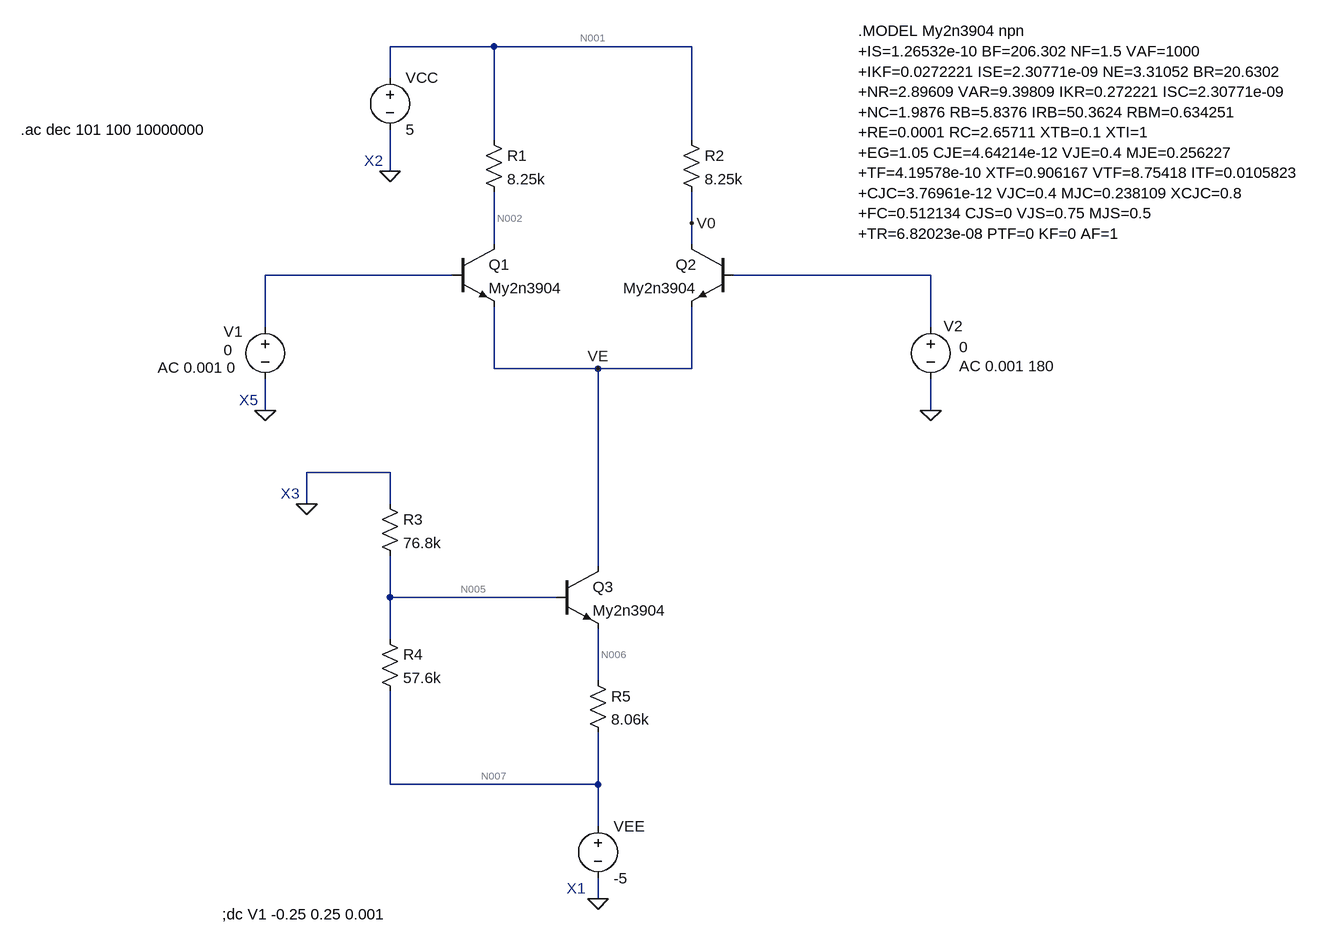
[diagram p0: schematic 3.2.asc]
3.2.asc, the LTspice schematic file:
Version 4
SHEET 1 1176 712
WIRE -128 -640 -288 -640
WIRE 176 -640 -128 -640
WIRE -288 -592 -288 -640
WIRE -128 -496 -128 -640
WIRE 176 -496 176 -640
WIRE -288 -448 -288 -512
WIRE 176 -368 176 -416
WIRE -128 -336 -128 -416
WIRE 176 -336 176 -368
WIRE -192 -288 -480 -288
WIRE 544 -288 240 -288
WIRE -480 -208 -480 -288
WIRE 544 -208 544 -288
WIRE -128 -144 -128 -240
WIRE 32 -144 -128 -144
WIRE 176 -144 176 -240
WIRE 176 -144 32 -144
WIRE -480 -80 -480 -128
WIRE 544 -80 544 -128
WIRE -288 16 -416 16
WIRE -416 64 -416 16
WIRE -288 64 -288 16
WIRE 32 160 32 -144
WIRE -288 208 -288 144
WIRE -32 208 -288 208
WIRE -288 272 -288 208
WIRE 32 336 32 256
WIRE -288 496 -288 352
WIRE 32 496 32 416
WIRE 32 496 -288 496
WIRE 32 560 32 496
WIRE 32 672 32 640
FLAG -288 -448 0
FLAG -480 -80 0
FLAG -416 64 0
FLAG 32 672 0
FLAG 32 -144 VE
FLAG 176 -368 V0
FLAG 544 -80 0
SYMBOL res -144 -512 R0
SYMATTR InstName R1
SYMATTR Value 8.25k
SYMBOL res 160 -512 R0
SYMATTR InstName R2
SYMATTR Value 8.25k
SYMBOL res -304 48 R0
SYMATTR InstName R3
SYMATTR Value 76.8k
SYMBOL res -304 256 R0
SYMATTR InstName R4
SYMATTR Value 57.6k
SYMBOL res 16 320 R0
SYMATTR InstName R5
SYMATTR Value 8.06k
SYMBOL voltage -288 -608 R0
WINDOW 123 0 0 Left 0
WINDOW 39 0 0 Left 0
SYMATTR InstName VCC
SYMATTR Value 5
SYMBOL npn -192 -336 R0
SYMATTR InstName Q1
SYMATTR Value My2n3904
SYMBOL npn 240 -336 M0
SYMATTR InstName Q2
SYMATTR Value My2n3904
SYMBOL voltage -480 -224 R0
WINDOW 0 -64 23 Left 2
WINDOW 3 -64 51 Left 2
WINDOW 123 -165 78 Left 2
WINDOW 39 0 0 Left 0
SYMATTR InstName V1
SYMATTR Value 0
SYMATTR Value2 AC 0.001 0
SYMBOL npn -32 160 R0
SYMATTR InstName Q3
SYMATTR Value My2n3904
SYMBOL voltage 32 544 R0
WINDOW 123 0 0 Left 0
WINDOW 39 0 0 Left 0
SYMATTR InstName VEE
SYMATTR Value -5
SYMBOL voltage 544 -224 R0
WINDOW 0 20 14 Left 2
WINDOW 3 44 47 Left 2
WINDOW 123 44 76 Left 2
WINDOW 39 0 0 Left 0
SYMATTR InstName V2
SYMATTR Value 0
SYMATTR Value2 AC 0.001 180
TEXT -328 -464 Left 2 ;X2
TEXT -520 -96 Left 2 ;X5
TEXT -456 48 Left 2 ;X3
TEXT -16 656 Left 2 ;X1
TEXT 432 -664 Left 2 !.MODEL My2n3904 npn\n+IS=1.26532e-10 BF=206.302 NF=1.5 VAF=1000\n+IKF=0.0272221 ISE=2.30771e-09 NE=3.31052 BR=20.6302\n+NR=2.89609 VAR=9.39809 IKR=0.272221 ISC=2.30771e-09\n+NC=1.9876 RB=5.8376 IRB=50.3624 RBM=0.634251\n+RE=0.0001 RC=2.65711 XTB=0.1 XTI=1\n+EG=1.05 CJE=4.64214e-12 VJE=0.4 MJE=0.256227\n+TF=4.19578e-10 XTF=0.906167 VTF=8.75418 ITF=0.0105823\n+CJC=3.76961e-12 VJC=0.4 MJC=0.238109 XCJC=0.8\n+FC=0.512134 CJS=0 VJS=0.75 MJS=0.5\n+TR=6.82023e-08 PTF=0 KF=0 AF=1
TEXT -546 696 Left 2 !;dc V1 -0.25 0.25 0.001
TEXT -856 -512 Left 2 !.ac dec 101 100 10000000

The netlist it stands for:
* 3.2.asc
R1 N001 N002 8.25k
R2 N001 V0 8.25k
R3 0 N005 76.8k
R4 N005 N007 57.6k
R5 N006 N007 8.06k
VCC N001 0 5
Q1 N002 N003 VE 0 My2n3904
Q2 V0 N004 VE 0 My2n3904
V1 N003 0 0 AC 0.001 0
Q3 VE N005 N006 0 My2n3904
VEE N007 0 -5
V2 N004 0 0 AC 0.001 180
.model NPN NPN
.model PNP PNP
.lib standard.bjt
* X2
* X5
* X3
* X1
.MODEL My2n3904 npn
+IS=1.26532e-10 BF=206.302 NF=1.5 VAF=1000
+IKF=0.0272221 ISE=2.30771e-09 NE=3.31052 BR=20.6302
+NR=2.89609 VAR=9.39809 IKR=0.272221 ISC=2.30771e-09
+NC=1.9876 RB=5.8376 IRB=50.3624 RBM=0.634251
+RE=0.0001 RC=2.65711 XTB=0.1 XTI=1
+EG=1.05 CJE=4.64214e-12 VJE=0.4 MJE=0.256227
+TF=4.19578e-10 XTF=0.906167 VTF=8.75418 ITF=0.0105823
+CJC=3.76961e-12 VJC=0.4 MJC=0.238109 XCJC=0.8
+FC=0.512134 CJS=0 VJS=0.75 MJS=0.5
+TR=6.82023e-08 PTF=0 KF=0 AF=1
;dc V1 -0.25 0.25 0.001
.ac dec 101 100 10000000
.backanno
.end

* Results of the author's LTspice run, read from the files saved beside the schematic
* Operating Point, zero values left out:
*   V(n001) = 5 V
*   V(n002) = 4.25 V
*   V(v0) = 4.25 V
*   V(n005) = -2.937 V
*   V(n007) = -5 V
*   V(n006) = -3.49 V
*   V(ve) = -525.4 mV
*   Ic(Q3) = 184.9 µA
*   Ib(Q3) = 2.429 µA
*   Ie(Q3) = -187.3 µA
*   Ic(Q2) = 90.91 µA
*   Ib(Q2) = 1.528 µA
*   Ie(Q2) = -92.44 µA
*   Ic(Q1) = 90.91 µA
*   Ib(Q1) = 1.528 µA
*   Ie(Q1) = -92.44 µA
*   I(R5) = 187.3 µA
*   I(R4) = 35.81 µA
*   I(R3) = 38.24 µA
*   I(R2) = 90.91 µA
*   I(R1) = 90.91 µA
*   I(V2) = -1.528 µA
*   I(Vee) = 223.1 µA
*   I(V1) = -1.528 µA
*   I(Vcc) = -181.8 µA
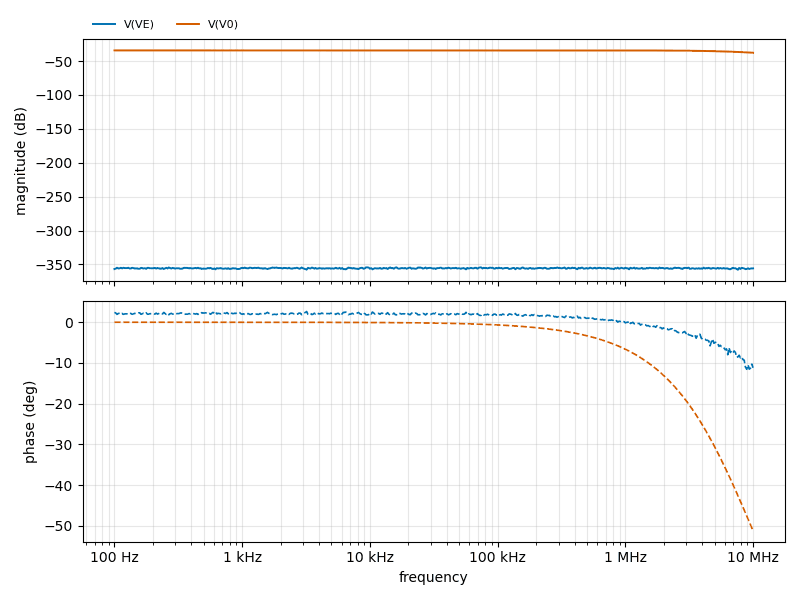
[diagram p1: AC Analysis of 3.2.asc, plotted from the saved traces]
* AC Analysis, 1 run:
*   V(VE): -356.72 dB at 100 Hz, -355.69 dB at 10 MHz, peak -354.24 dB at 9.554 kHz, 3 dB below the peak at 3.207 kHz and 56.55 kHz
*   V(V0): -34.35 dB at 100 Hz, -37.79 dB at 10 MHz, peak -34.35 dB at 100 Hz, 3 dB below the peak at 9.104 MHz